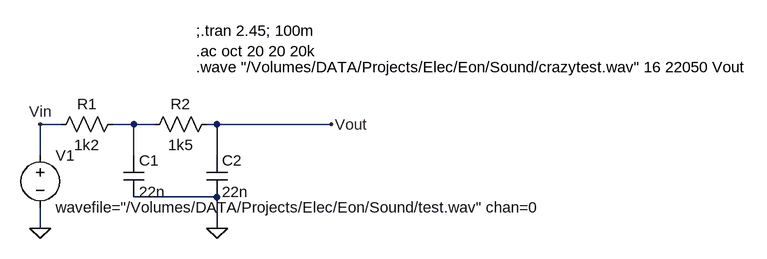
[diagram p0: schematic crazycircuit.asc]
crazycircuit.asc, the LTspice schematic file:
Version 4
SHEET 1 1240 680
WIRE 112 272 80 272
WIRE 224 272 192 272
WIRE 256 272 224 272
WIRE 352 272 336 272
WIRE 528 272 352 272
WIRE 80 320 80 272
WIRE 224 320 224 272
WIRE 352 320 352 272
WIRE 352 384 224 384
WIRE 80 432 80 400
WIRE 352 432 352 384
FLAG 352 432 0
FLAG 80 432 0
FLAG 528 272 Vout
FLAG 80 272 Vin
SYMBOL res 208 256 R90
WINDOW 0 0 56 VBottom 2
WINDOW 3 32 56 VTop 2
SYMATTR InstName R1
SYMATTR Value 1k2
SYMBOL res 352 256 R90
WINDOW 0 0 56 VBottom 2
WINDOW 3 32 56 VTop 2
SYMATTR InstName R2
SYMATTR Value 1k5
SYMBOL cap 208 320 R0
SYMATTR InstName C1
SYMATTR Value 22n
SYMBOL cap 336 320 R0
SYMATTR InstName C2
SYMATTR Value 22n
SYMBOL voltage 80 304 R0
SYMATTR InstName V1
SYMATTR Value wavefile="/Volumes/DATA/Projects/Elec/Eon/Sound/test.wav" chan=0
TEXT 320 184 Left 2 !.wave "/Volumes/DATA/Projects/Elec/Eon/Sound/crazytest.wav" 16 22050 Vout
TEXT 320 128 Left 2 !;.tran 2.45; 100m\n.ac oct 20 20 20k

The netlist it stands for:
* crazycircuit.asc
R1 N001 Vin 1k2
R2 Vout N001 1k5
C1 N001 0 22n
C2 Vout 0 22n
V1 Vin 0 wavefile="/Volumes/DATA/Projects/Elec/Eon/Sound/test.wav" chan=0
.wave "/Volumes/DATA/Projects/Elec/Eon/Sound/crazytest.wav" 16 22050 Vout
;.tran 2.45; 100m
.ac oct 20 20 20k
.backanno
.end